# EAGLE schematic main (EAGLE 9.2.2)
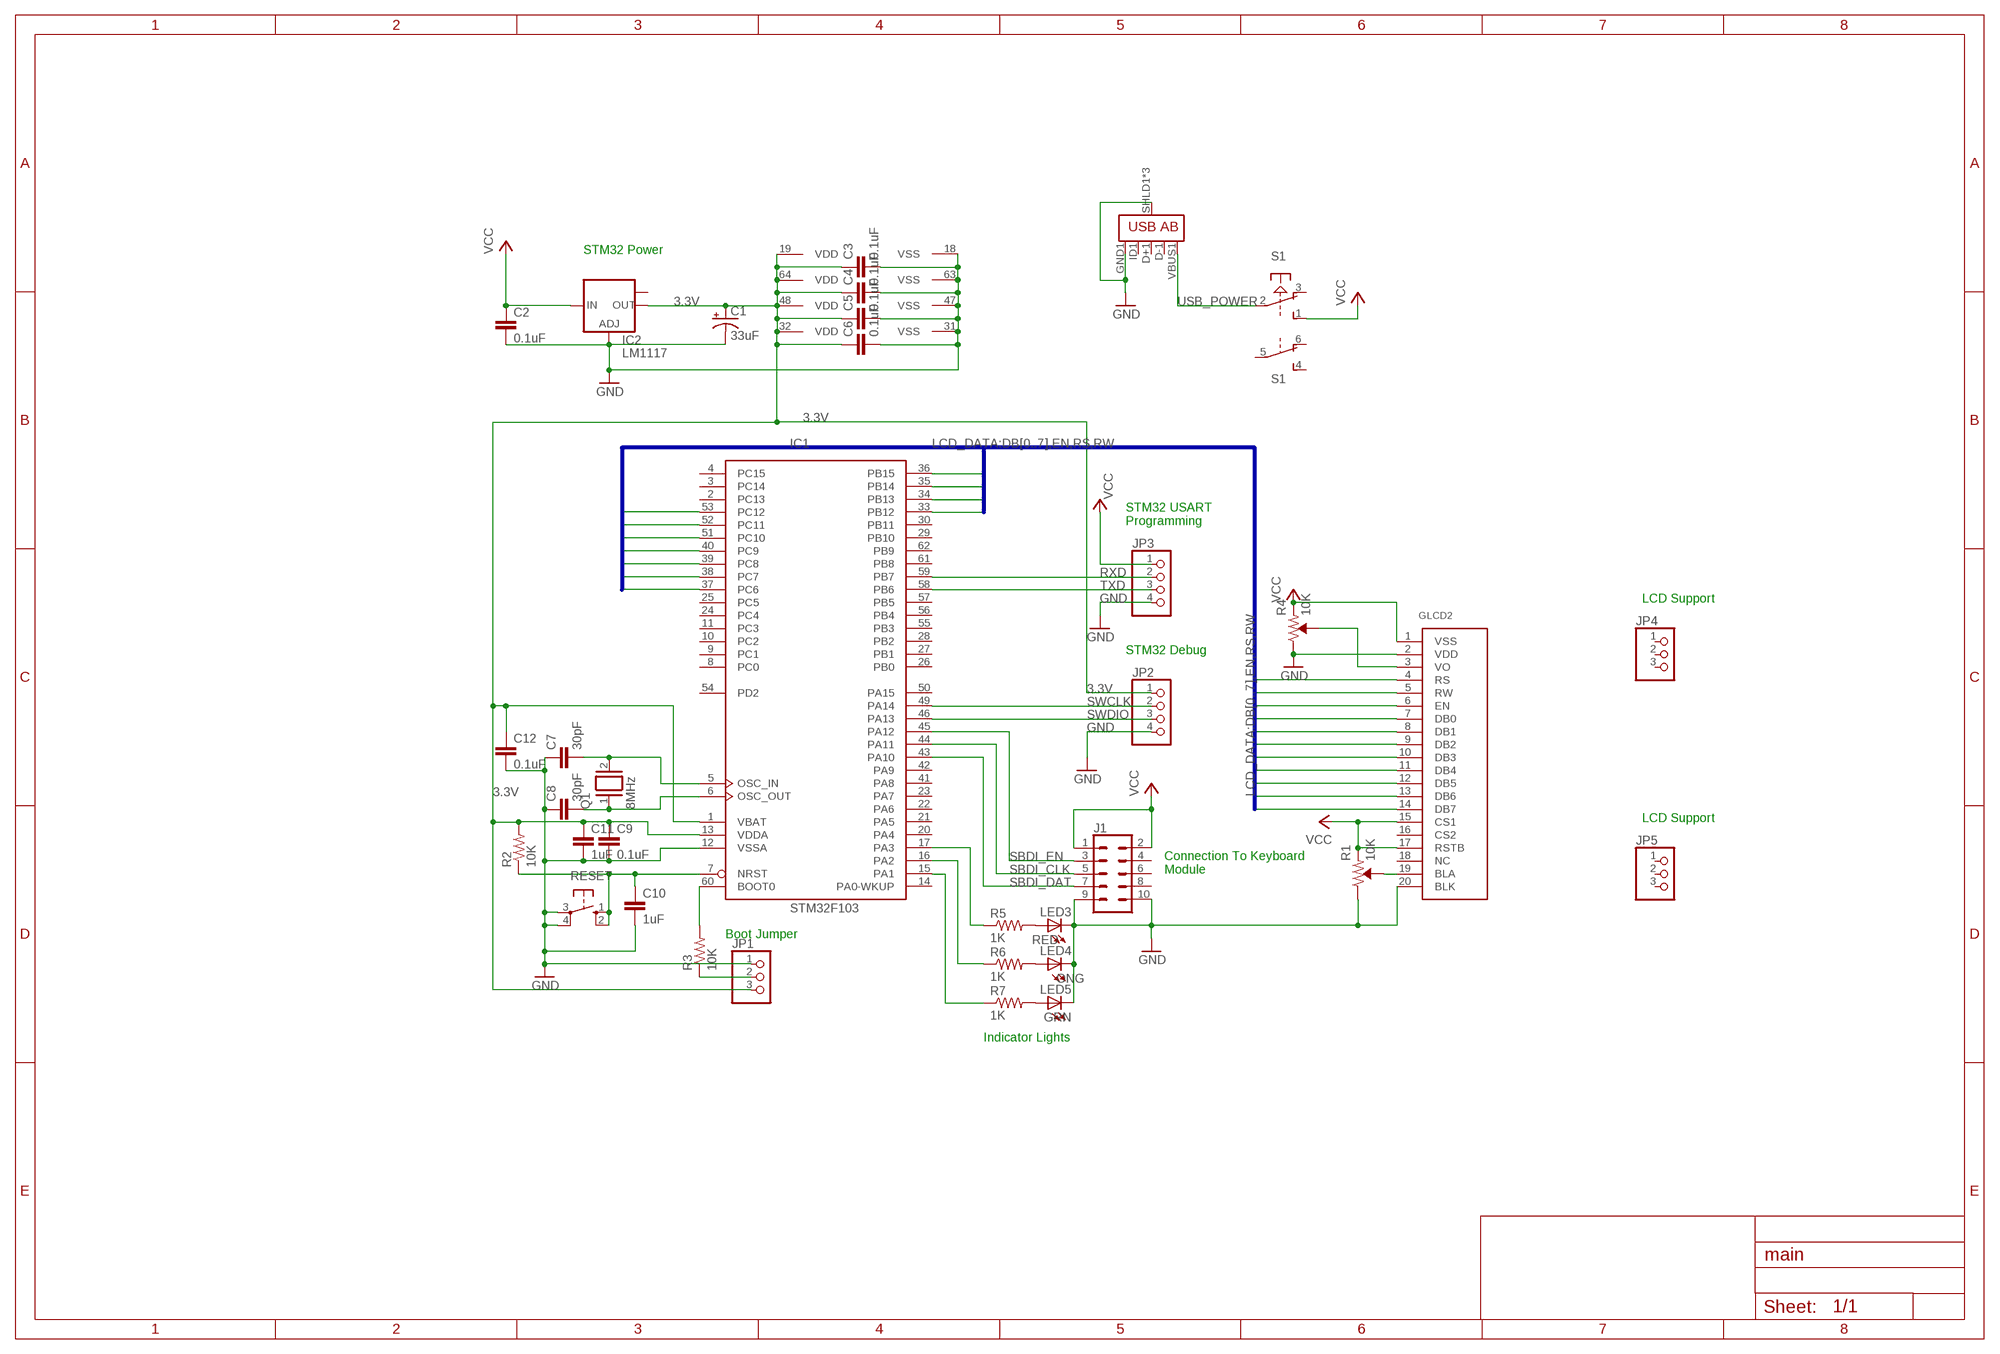
[diagram p0: schematic, sheet 1]

## Parts
C1  33uF  CPOL-USE2-5  [E2-5]
C2  0.1uF  C-EU025-025X050  [C025-025X050]
C3  0.1uF  C-EU025-025X050  [C025-025X050]
C4  0.1uF  C-EU025-025X050  [C025-025X050]
C5  0.1uF  C-EU025-025X050  [C025-025X050]
C6  0.1uF  C-EU025-025X050  [C025-025X050]
C7  30pF  C-EU025-025X050  [C025-025X050]
C8  30pF  C-EU025-025X050  [C025-025X050]
C9  0.1uF  C-EU025-025X050  [C025-025X050]
C10  1uF  C-EU025-025X050  [C025-025X050]
C11  1uF  C-EU025-025X050  [C025-025X050]
C12  0.1uF  C-EU025-025X050  [C025-025X050]
GLCD2  LCD128X64  [GLCD_TRULY_128X64_20_PINES]
IC1  STM32F103  STM32F103RCT  [LQFP64]
IC2  LM1117  LM1117IMPX-ADJ  [SOT223]
J1  CONN_05X2SHD_LOCK  [2X5-SHROUDED_LOCK]
JP1  PINHD-1X3  [1X03]
JP2  PINHD-1X4  [1X04]
JP3  PINHD-1X4  [1X04]
JP4  PINHD-1X3  [1X03]
JP5  PINHD-1X3  [1X03]
LED3  RED  LED5MM  [LED5MM]
LED4  ONG  LED5MM  [LED5MM]
LED5  GRN  LED5MM  [LED5MM]
Q1  8MHz  XTAL/S  [QS]
R1  10K  TRIMPOT-KNOB  [TRIMPOT-PTH-3386U]
R2  10K  R-US_0204/7  [0204/7]
R3  10K  R-US_0204/7  [0204/7]
R4  10K  TRIMPOT-KNOB  [TRIMPOT-PTH-3386U]
R5  1K  R-US_0204/7  [0204/7]
R6  1K  R-US_0204/7  [0204/7]
R7  1K  R-US_0204/7  [0204/7]
RESET  10-XX  [B3F-10XX]
S1  PVA2R  [PVA2R]
U1  USB_AB_SMT  [USB-AB-MICRO-SMD]

## Nets
3.3V: C1.+ C3.1 C4.1 C5.1 C6.1 C9.1 C11.1 C12.1 IC1.1(VBAT) IC1.13(VDDA) IC1.19(VDD) IC1.32(VDD) IC1.48(VDD) IC1.64(VDD) IC2.2(OUT) JP1.3 JP2.1 R2.2
DB0: GLCD2.7(DB0) IC1.33(PB12)
DB1: GLCD2.8(DB1) IC1.34(PB13)
DB2: GLCD2.9(DB2) IC1.35(PB14)
DB3: GLCD2.10(DB3) IC1.36(PB15)
DB4: GLCD2.11(DB4) IC1.37(PC6)
DB5: GLCD2.12(DB5) IC1.38(PC7)
DB6: GLCD2.13(DB6) IC1.39(PC8)
DB7: GLCD2.14(DB7) IC1.40(PC9)
EN: GLCD2.6(EN) IC1.53(PC12)
GND: C1.- C2.2 C3.2 C4.2 C5.2 C6.2 C7.1 C8.1 C9.2 C10.2 C11.2 C12.2 GLCD2.2(VDD) GLCD2.20(BLK) IC1.12(VSSA) IC1.18(VSS) IC1.31(VSS) IC1.47(VSS) IC1.63(VSS) IC2.1(ADJ) J1.9 J1.10 JP1.1 JP2.4 JP3.4 LED3.K(C) LED4.K(C) LED5.K(C) R1.1 R4.1 RESET.3(P) RESET.4(P1) U1.GND1(GND) U1.SHLD1(SHIELD) U1.SHLD2(SHIELD) U1.SHLD3(SHIELD)
N$1: GLCD2.19(BLA) R1.2
N$2: GLCD2.3(VO) R4.2
N$3: LED3.A R5.2
N$4: LED4.A R6.2
N$5: C7.2 IC1.5(OSC_IN) Q1.2
N$6: C10.1 IC1.7(NRST) R2.1 RESET.1(S) RESET.2(S1)
N$7: C8.2 IC1.6(OSC_OUT) Q1.1
N$9: IC1.15(PA1) R7.1
N$10: IC1.60(BOOT0) R3.2
N$11: JP1.2 R3.1
N$13: IC1.16(PA2) R6.1
N$14: IC1.17(PA3) R5.1
N$15: LED5.A R7.2
RS: GLCD2.4(RS) IC1.51(PC10)
RW: GLCD2.5(RW) IC1.52(PC11)
RXD: IC1.59(PB7) JP3.2
SBDI_CLK: IC1.44(PA11) J1.5
SBDI_DAT: IC1.43(PA10) J1.7
SBDI_EN: IC1.45(PA12) J1.3
SWCLK: IC1.49(PA14) JP2.2
SWDIO: IC1.46(PA13) JP2.3
TXD: IC1.58(PB6) JP3.3
USB_POWER: S1.2(1:P) U1.VBUS1(VBUS)
VCC: C2.1 GLCD2.1(VSS) GLCD2.15(CS1) GLCD2.17(RSTB) IC2.3(IN) J1.1 J1.2 JP3.1 R1.3 R4.3 S1.1(1:S)
Unconnected: GLCD2.16(CS2) GLCD2.18(NC) IC1.2(PC13) IC1.3(PC14) IC1.4(PC15) IC1.8(PC0) IC1.9(PC1) IC1.10(PC2) IC1.11(PC3) IC1.14(PA0-WKUP) IC1.20(PA4) IC1.21(PA5) IC1.22(PA6) IC1.23(PA7) IC1.24(PC4) IC1.25(PC5) IC1.26(PB0) IC1.27(PB1) IC1.28(PB2) IC1.29(PB10) IC1.30(PB11) IC1.41(PA8) IC1.42(PA9) IC1.50(PA15) IC1.54(PD2) IC1.55(PB3) IC1.56(PB4) IC1.57(PB5) IC1.61(PB8) IC1.62(PB9) IC2.TAB(OUT1) J1.4 J1.6 J1.8 JP4.1 JP4.2 JP4.3 JP5.1 JP5.2 JP5.3 S1.3(1:O) S1.4(2:S) S1.5(2:P) S1.6(2:O) U1.D+1(D+) U1.D-1(D-) U1.ID1(USBID)

## Buses
LCD_DATA:DB[0..7],EN,RS,RW

## Notes on the sheet
- STM32 Power
- STM32 USART
  Programming
- LCD Support
- STM32 Debug
- LCD Support
- Connection To Keyboard
  Module
- Boot Jumper
- Indicator Lights

## Library data of the parts
C1 = rcl:CPOL-US: POLARIZED CAPACITOR, American symbol; SPICEPREFIX: C
C2-C12 = rcl:C-EU: CAPACITOR, European symbol; SPICEPREFIX: C
GLCD2 = glcd_truly_128x64_20_pines:LCD128X64
IC1 = micro-stm_v3:STM32F103R*T: ARM 32-bit Cortex™-M3 CPU 72 MHz maximum frequency 16 to 1024 Kbytes of Flash memory 6 to 96 kbytes of SRAM 51 GPIOs 2.0 to 3.6 V application supply
IC2 = lm1117:LM1117IMPX-ADJ
J1 = SparkFun-Connectors:CONN_05X2: Multi connection point. Often used as Generic Header-pin footprint for 0.1 inch spaced/style header connections For AVR SPI programming port, see special device with nice symbol: "AVR_SPI_PROG_5x2.dev" You can populate with any combo of single row headers, but if you'd like an exact match, check these: 2x5 AVR ICSP Male Header <https://www.sparkfun.com/products/778> (PRT-00778) 2x5 Pin Shrouded Header <https://www.sparkfun.com/products/8506> (PRT-08506) On any of the 0.1 inch spaced packages, you can populate with these: Break Away Headers - Straight <https://www.sparkfun.com/products/116> (PRT-00116) Break Away Male Headers - Right Angle <https://www.sparkfun.com/products/553> (PRT-00553) Female Headers <https://www.sparkfun.com/products/115> (PRT-00115) Break Away Headers - Machine Pin <https://www.sparkfun.com/products/117> (PRT-00117) Break Away Female Headers - Swiss Machine Pin <https://www.sparkfun.com/products/743> (PRT-00743) Special note: the shrouded connector mates well with our 5x2 ribbon cables: 2x5 Pin IDC Ribbon Cable <https://www.sparkfun.com/products/8535> (PRT-08535); PROD_ID: CONN-08671; SF_ID: PRT-08506
JP1 JP4 JP5 = pinhead:PINHD-1X3: PIN HEADER
JP2 JP3 = pinhead:PINHD-1X4: PIN HEADER
LED3-LED5 = led:LED: LED OSRAM: - CHIPLED LG R971, LG N971, LY N971, LG Q971, LY Q971, LO R971, LY R971 LH N974, LH R974 LS Q976, LO Q976, LY Q976 LO Q996 - Hyper CHIPLED LW Q18S LB Q993, LB Q99A, LB R99A - SideLED LS A670, LO A670, LY A670, LG A670, LP A670 LB A673, LV A673, LT A673, LW A673 LH A674 LY A675 LS A676, LA A676, LO A676, LY A676, LW A676 LS A679, LY A679, LG A679 - Hyper Micro SIDELED® LS Y876, LA Y876, LO Y876, LY Y876 LT Y87S - SmartLED LW L88C, LW L88S LB L89C, LB L89S, LG L890 LS L89K, LO L89K, LY L89K LS L896, LA L896, LO L896, LY L896 - TOPLED LS T670, LO T670, LY T670, LG T670, LP T670 LSG T670, LSP T670, LSY T670, LOP T670, LYG T670 LG T671, LOG T671, LSG T671 LB T673, LV T673, LT T673, LW T673 LH T674 LS T676, LA T676, LO T676, LY T676, LB T676, LH T676, LSB T676, LW T676 LB T67C, LV T67C, LT T67C, LS T67K, LO T67K, LY T67K, LW E67C LS E67B, LA E67B, LO E67B, LY E67B, LB E67C, LV E67C, LT E67C LW T67C LS T679, LY T679, LG T679 LS T770, LO T770, LY T770, LG T770, LP T770 LB T773, LV T773, LT T773, LW T773 LH T774 LS E675, LA E675, LY E675, LS T675 LS T776, LA T776, LO T776, LY T776, LB T776 LHGB T686 LT T68C, LB T68C - Hyper Mini TOPLED® LB M676 - Mini TOPLED Santana® LG M470 LS M47K, LO M47K, LY M47K Source: http://www.osram.convergy.de LUXEON: - LUMILED® LXK2-PW12-R00, LXK2-PW12-S00, LXK2-PW14-U00, LXK2-PW14-V00 LXK2-PM12-R00, LXK2-PM12-S00, LXK2-PM14-U00 LXK2-PE12-Q00, LXK2-PE12-R00, LXK2-PE12-S00, LXK2-PE14-T00, LXK2-PE14-U00 LXK2-PB12-K00, LXK2-PB12-L00, LXK2-PB12-M00, LXK2-PB14-N00, LXK2-PB14-P00, LXK2-PB14-Q00 LXK2-PR12-L00, LXK2-PR12-M00, LXK2-PR14-Q00, LXK2-PR14-R00 LXK2-PD12-Q00, LXK2-PD12-R00, LXK2-PD12-S00 LXK2-PH12-R00, LXK2-PH12-S00 LXK2-PL12-P00, LXK2-PL12-Q00, LXK2-PL12-R00 Source: www.luxeon.com KINGBRIGHT: KA-3528ASYC Source: www.kingbright.com
Q1 = special:XTAL/S: CRYSTAL
R1 R4 = TCalc:TRIMPOT-KNOB
R2 R3 R5-R7 = rcl:R-US_: RESISTOR, American symbol; SPICEPREFIX: R
RESET = switch-omron:10-XX: OMRON SWITCH; MPN: B3F-1000; OC_FARNELL: 176432; OC_NEWARK: 36M3542
S1 = switch-misc:PVA2R: ITT SWITCH
U1 = SparkFun-Connectors:USB_AB: USB Type AB Micro Connector OTG-compatible. 5 pins, 3 shield pins SparkFun Products: IOIO-OTG <https://www.sparkfun.com/products/13613> SparkFun SAMD21 Mini Breakout <https://www.sparkfun.com/products/13664>; PROD_ID: CONN-11794